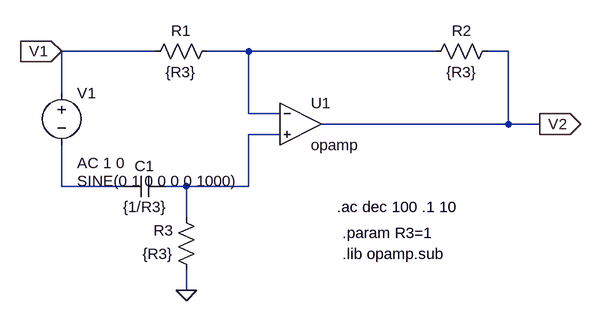
[diagram p0: schematic TS0.asc]
TS0.asc, the LTspice schematic file:
Version 4
SHEET 1 888 680
WIRE 208 32 64 32
WIRE 352 32 288 32
WIRE 640 32 352 32
WIRE 752 32 720 32
WIRE 64 96 64 32
WIRE 352 128 352 32
WIRE 400 128 352 128
WIRE 752 144 752 32
WIRE 752 144 464 144
WIRE 800 144 752 144
WIRE 400 160 352 160
WIRE 64 240 64 176
WIRE 160 240 64 240
WIRE 256 240 224 240
WIRE 352 240 352 160
WIRE 352 240 256 240
WIRE 256 288 256 240
WIRE 256 400 256 368
FLAG 256 400 0
FLAG 64 32 V1
IOPIN 64 32 In
FLAG 800 144 V2
IOPIN 800 144 Out
SYMBOL voltage 64 80 R0
WINDOW 123 24 124 Left 2
WINDOW 39 0 0 Left 0
WINDOW 3 24 152 Left 2
SYMATTR Value2 AC 1 0
SYMATTR InstName V1
SYMATTR Value SINE(0 1 0 0 0 0 1000)
SYMBOL res 304 16 R90
WINDOW 0 0 56 VBottom 2
WINDOW 3 32 56 VTop 2
SYMATTR InstName R1
SYMATTR Value {R3}
SYMBOL res 736 16 R90
WINDOW 0 0 56 VBottom 2
WINDOW 3 32 56 VTop 2
SYMATTR InstName R2
SYMATTR Value {R3}
SYMBOL res 272 384 R180
WINDOW 0 36 76 Left 2
WINDOW 3 36 40 Left 2
SYMATTR InstName R3
SYMATTR Value {R3}
SYMBOL cap 224 224 R90
WINDOW 0 0 32 VBottom 2
WINDOW 3 32 32 VTop 2
SYMATTR InstName C1
SYMATTR Value {1/R3}
SYMBOL OpAmps\\opamp 432 80 R0
SYMATTR InstName U1
TEXT 488 272 Left 2 !.ac dec 100 .1 10
TEXT 496 312 Left 2 !.param R3=1
TEXT 496 344 Left 2 !.lib opamp.sub

The netlist it stands for:
* TS0.asc
V1 V1 N003 SINE(0 1 0 0 0 0 1000) AC 1 0
R1 N001 V1 {R3}
R2 V2 N001 {R3}
R3 0 N002 {R3}
C1 N002 N003 {1/R3}
XU1 N001 N002 V2 opamp Aol=100K GBW=10Meg  ; pins invin noninvin out
.ac dec 100 .1 10
.param R3=1
.lib opamp.sub
.backanno
.end

* Results of the author's LTspice run, read from the files saved beside the schematic
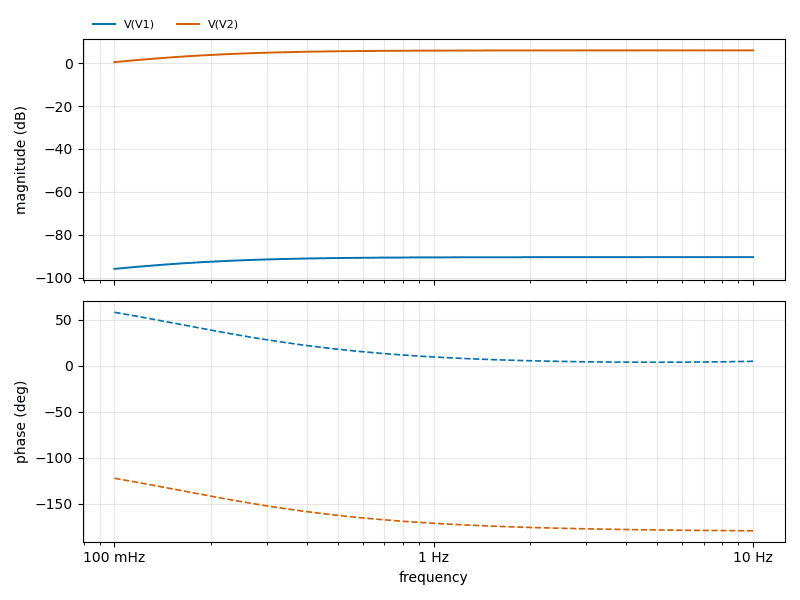
[diagram p1: AC Analysis of TS0.asc, plotted from the saved traces]
* AC Analysis, 1 run:
*   V(V1): -95.94 dB at 100 mHz, -90.44 dB at 10 Hz, peak -90.44 dB at 10 Hz, 3 dB below the peak at 159.8 mHz
*   V(V2): 0.54 dB at 100 mHz, 6.02 dB at 10 Hz, peak 6.02 dB at 10 Hz, 3 dB below the peak at 159.1 mHz